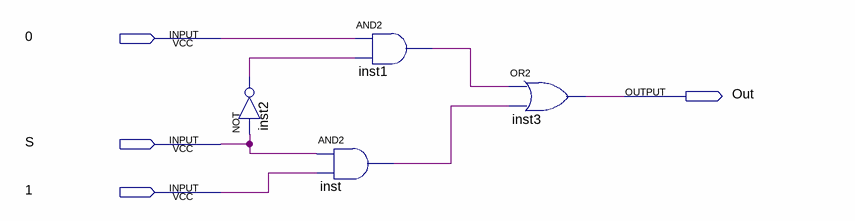
[diagram p0: schematic sheet]
// Quartus schematic 21mux.bdf as structural Verilog: 4 symbols, 4 pins
module \21mux  (
  input  \0 ,
  input  S,
  input  \1 ,
  output Out
);

  wire inst1_out, inst2_out, inst_out;

  not inst2 (inst2_out, S);
  and inst1 (inst1_out, \0 , inst2_out);
  and inst (inst_out, S, \1 );
  or inst3 (Out, inst1_out, inst_out);
endmodule
